# Altium schematic sheet CW308T_87C51_CWCONN.SchDoc: CW308 Connections
size Letter; Organization: NewAE Technology Inc.; Address1: 1083 Queen St., Suite 196; Address2: Halifax; Address3: NS; Address4: Canada B3H 0B2; SheetApproved: YES
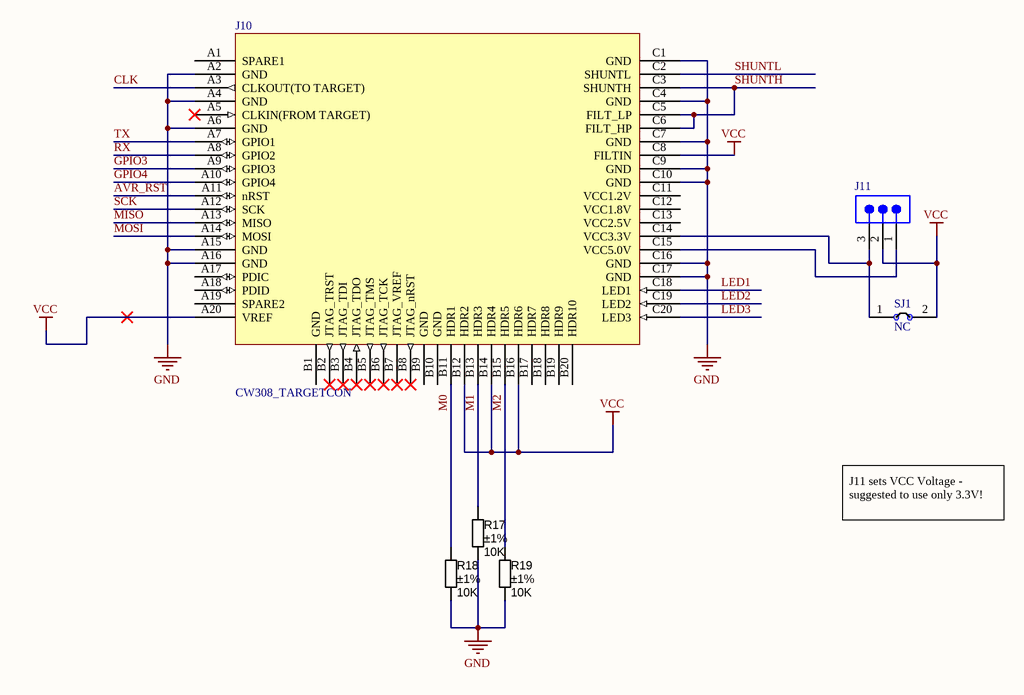
[diagram p0: CW308T_87C51_CWCONN.SchDoc]

## Parts
J10  CW308_TARGETCON  [CW308_TBOARD_CONN]
J11  68000-203HLF  [SMTC-TSW-103-07-X-S]  (value not drawn)
R17  value 10K  Tolerance: ±1%  [RESC1608X55N]  (hidden comment: Thick Film)
R18  value 10K  Tolerance: ±1%  [RESC1608X55N]  (hidden comment: Thick Film)
R19  value 10K  Tolerance: ±1%  [RESC1608X55N]  (hidden comment: Thick Film)
SJ1  NC  [SJ_2S_NC]  (no BOM)

## Nets
GND: J10.A2(GND) J10.A4(GND) J10.A6(GND) J10.A15(GND) J10.A16(GND) J10.C1(GND) J10.C4(GND) J10.C7(GND) J10.C9(GND) J10.C10(GND) J10.C16(GND) J10.C17(GND) R17.2 R18.2 R19.1
VCC: J10.A20(VREF) J10.B12(HDR2) J10.B14(HDR4) J10.B16(HDR6) J10.C8(FILTIN) J11.2 SJ1.2
AVR_RST: J10.A11(nRST)
CLK: J10.A3(CLKOUT(TO_TARGET))
GPIO3: J10.A9(GPIO3)
GPIO4: J10.A10(GPIO4)
LED1: J10.C18(LED1)
LED2: J10.C19(LED2)
LED3: J10.C20(LED3)
M0: J10.B11(HDR1) R18.1
M1: J10.B13(HDR3) R17.1
M2: J10.B15(HDR5) R19.2
MISO: J10.A13(MISO)
MOSI: J10.A14(MOSI)
RX: J10.A8(GPIO2)
SCK: J10.A12(SCK)
SHUNTH: J10.C3(SHUNTH) J10.C5(FILT_LP) J10.C6(FILT_HP)
SHUNTL: J10.C2(SHUNTL)
TX: J10.A7(GPIO1)
NetJ10_C14: J10.C14(VCC3.3V) J11.3 SJ1.1
NetJ10_C15: J10.C15(VCC5.0V) J11.1

Not connected (* = marked no-connect by the designer): J10 A1(SPARE1) A5(CLKIN(FROM_TARGET))* A17(PDIC) A18(PDID) A19(SPARE2) B1(GND) B2(JTAG_TRST)* B3(JTAG_TDI)* B4(JTAG_TDO)* B5(JTAG_TMS)* B6(JTAG_TCK)* B7(JTAG_VREF)* B8(JTAG_nRST)* B9(GND) B10(GND) B17(HDR7) B18(HDR8) B19(HDR9) B20(HDR10) C11(VCC1.2V) C12(VCC1.8V) C13(VCC2.5V)

## Notes on the sheet
- J11 sets VCC Voltage - suggested to use only 3.3V!
- Title:
- Date:
- Rev:
- Time:
- Project:
- Sheet
- of
- License:
- Copyright © NewAE Technology Inc.
- Approved:
- NewAE.com
- File:

## Library data of the parts
J10 = CW308_TBOARD: CW308 "Standard" Target Board Connector
J11 = CMP-1024-00333-1: Manufacturer: Samtec; Pitch: 2.54 mm; Temperature Range: -55 to 125 degC; RoHS: True; Orientation: Vertical; PackageDescription: .025[0.64] SQ. Post Terminal Strip Assembly; Mounting Technology: Through-hole; PartNumber: 68000-203HLF; Supplier 1: Digi-Key; Supplier Part Number 1: 609-3464-ND
R17-R19 = RES_10K_0603_1%: Resistor SMD chip 10k Ohm 0.1W 1% 0603; Manufacturer 1: Yageo; Manufacturer Part Number 1: RC0603FR-0710KL; Ratings: 1/10W; SCDType: spec; Package / Case: 0603 (1608 Metric); Supplier 1: Digi-Key; Supplier Part Number 1: 311-10.0KHRCT-ND
SJ1 = SJ_2S: Solder Jumper, NC; Component Group: PCB Feature; Part Number: SJ_2S; Pin Count: 2; Mounting Technology: COPPER; Component Type: Standard (No BOM)